# EAGLE schematic schematic (EAGLE 6.3)
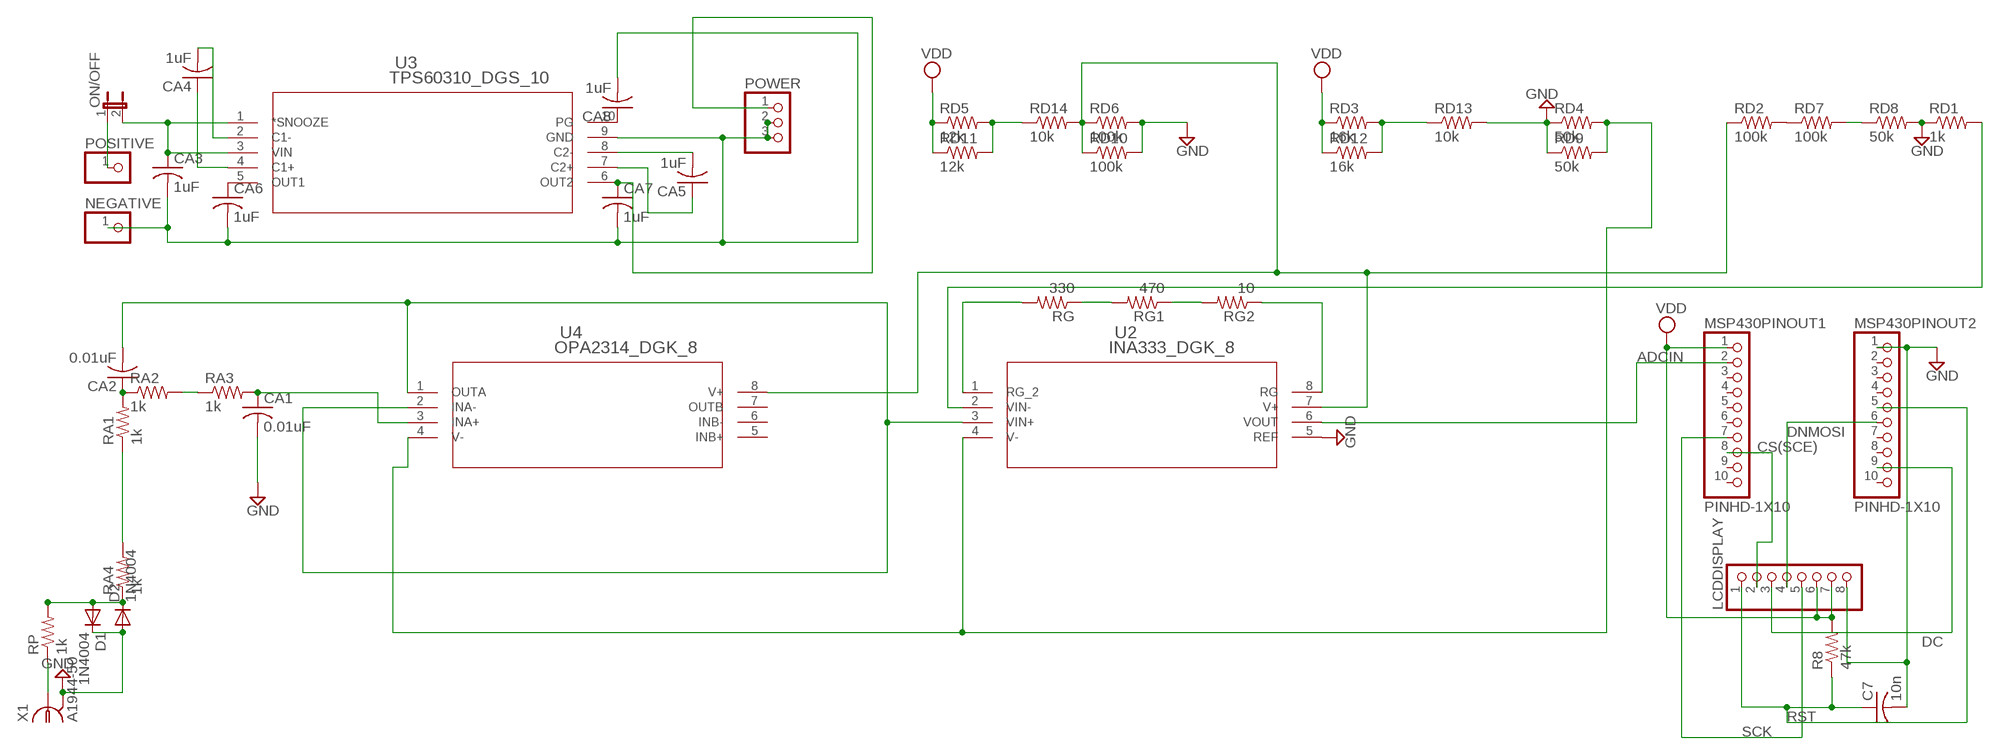
[diagram p0: schematic, sheet 1]

## Parts
C7  10n  C-US025-024X044  [C025-024X044]
CA1  0.01uF  C-US025-024X044  [C025-024X044]
CA2  0.01uF  C-US025-024X044  [C025-024X044]
CA3  1uF  C-US025-024X044  [C025-024X044]
CA4  1uF  C-US025-024X044  [C025-024X044]
CA5  1uF  C-US025-024X044  [C025-024X044]
CA6  1uF  C-US025-024X044  [C025-024X044]
CA7  1uF  C-US025-024X044  [C025-024X044]
CA8  1uF  C-US025-024X044  [C025-024X044]
D1  1N4004  [DO41-10]
D2  1N4004  [DO41-10]
LCDDISPLAY  PINHD-1X8BIG  [1X08-BIG]
MSP430PINOUT1  PINHD-1X10  [1X10-BIG]
MSP430PINOUT2  PINHD-1X10  [1X10-BIG]
NEGATIVE  PINHD-1X1  [1X01]
ON/OFF  JP1E  [JP1]
POSITIVE  PINHD-1X1  [1X01]
POWER  PINHD-1X3  [1X03]
R8  47k  R-US_0204/7  [0204/7]
RA1  1k  R-US_0204/7  [0204/7]
RA2  1k  R-US_0204/7  [0204/7]
RA3  1k  R-US_0204/7  [0204/7]
RA4  1k  R-US_0204/7  [0204/7]
RD1  1k  R-US_0204/7  [0204/7]
RD2  100k  R-US_0204/7  [0204/7]
RD3  16k  R-US_0204/7  [0204/7]
RD4  50k  R-US_0204/7  [0204/7]
RD5  12k  R-US_0204/7  [0204/7]
RD6  100k  R-US_0204/7  [0204/7]
RD7  100k  R-US_0204/7  [0204/7]
RD8  50k  R-US_0204/7  [0204/7]
RD9  50k  R-US_0204/7  [0204/7]
RD10  100k  R-US_0204/7  [0204/7]
RD11  12k  R-US_0204/7  [0204/7]
RD12  16k  R-US_0204/7  [0204/7]
RD13  10k  R-US_0204/7  [0204/7]
RD14  10k  R-US_0204/7  [0204/7]
RG  330  R-US_0204/7  [0204/7]
RG1  470  R-US_0204/7  [0204/7]
RG2  10  R-US_0204/7  [0204/7]
RP  1k  R-US_0204/7  [0204/7]
U2  INA333_DGK_8  [DGK8]
U3  TPS60310_DGS_10  [DGS10]
U4  OPA2314_DGK_8  [DGK8]
X1  A1944-50  [A1944]

## Nets
ADCIN: MSP430PINOUT1.2 U2.6(VOUT)
CS(SCE): LCDDISPLAY.2 MSP430PINOUT1.8
DC: LCDDISPLAY.3 MSP430PINOUT2.9
DNMOSI: LCDDISPLAY.4 MSP430PINOUT2.6
GND: C7.2 CA1.2 D1.C D2.A LCDDISPLAY.8 MSP430PINOUT2.1 RD1.1 RD4.1 RD6.2 RD8.2 RD9.1 RD10.2 RD13.2 U2.5(REF) X1.2(GND)
N$1: CA3.1 ON/OFF.2 U3.1(*SNOOZE) U3.3(VIN)
N$2: RG1.2 RG.1
N$3: RG1.1 RG2.2
N$4: CA2.2 U2.3(VIN+) U4.1(OUTA) U4.2(INA-)
N$5: D1.A D2.C RA4.1 RP.2
N$6: CA6.1 U3.5(OUT1)
N$7: RP.1 X1.1
N$8: CA2.1 RA1.2 RA2.1
N$9: RG2.1 U2.8(RG)
N$10: CA3.2 CA6.2 CA7.2 CA8.2 NEGATIVE.1 POWER.2 POWER.3 U3.9(GND)
N$11: CA4.1 U3.4(C1+)
N$12: CA4.2 U3.2(C1-)
N$13: RA1.1 RA4.2
N$14: CA5.1 U3.7(C2+)
N$15: CA5.2 U3.8(C2-)
N$16: ON/OFF.1 POSITIVE.1
N$17: RA2.2 RA3.1
N$18: CA1.1 RA3.2 U4.3(INA+)
N$19: CA7.1 POWER.1 U3.6(OUT2)
N$20: CA8.1 U3.10(PG)
N$21: RG.2 U2.1(RG_2)
N$22: RD2.2 RD7.1
N$23: RD7.2 RD8.1
N$24: RD5.2 RD11.2 RD14.1
N$25: RD3.2 RD12.2 RD13.1
RST: C7.1 LCDDISPLAY.1 MSP430PINOUT2.5 R8.1
SCK: LCDDISPLAY.5 MSP430PINOUT1.7
VD: RD2.1 RD6.1 RD10.1 RD14.2 U2.7(V+) U4.8(V+)
VDD: LCDDISPLAY.6 LCDDISPLAY.7 MSP430PINOUT1.1 R8.2 RD3.1 RD5.1 RD11.1 RD12.1
VND: RD4.2 RD9.2 U2.4(V-) U4.4(V-)
VZ: RD1.2 U2.2(VIN-)
Unconnected: MSP430PINOUT1.3 MSP430PINOUT1.4 MSP430PINOUT1.5 MSP430PINOUT1.6 MSP430PINOUT1.9 MSP430PINOUT1.10 MSP430PINOUT2.2 MSP430PINOUT2.3 MSP430PINOUT2.4 MSP430PINOUT2.7 MSP430PINOUT2.8 MSP430PINOUT2.10 U4.5(INB+) U4.6(INB-) U4.7(OUTB)

## Power pins joined to a net without a drawn wire
GND: X1.3(GND) X1.4(GND) X1.5(GND)

## Library data of the parts
C7 CA1-CA8 = adafruit:C-US: CAPACITOR, American symbol
D1 D2 = diode:1N4004: DIODE general purpose rectifier, 1 A
LCDDISPLAY = adafruit:PINHD-1X8: PIN HEADER
MSP430PINOUT1 MSP430PINOUT2 = adafruit:PINHD-1X10: Pin header 1x10 0.1" spacing With round pins
NEGATIVE POSITIVE = pinhead:PINHD-1X1: PIN HEADER
ON/OFF = jumper:JP1E: JUMPER
POWER = pinhead:PINHD-1X3: PIN HEADER
R8 RA1-RA4 RD1-RD14 RG RG1 RG2 RP = adafruit:R-US_: RESISTOR, American symbol
U2 = TI-INA333:INA333_DGK_8; DATASHEETURL: http://www.ti.com/lit/gpn/INA333; DESCRIPTION: Low Power, Precision Instrumentation Amplifier; FAMILY_NAME: SINGLE SUPPLY; GENERIC_PART_NUMBER: INA333; INDUSTRY_STD_PKG_TYPE: MSOP; MANUFACTURER: Texas Instruments; MANUFACTURER_PART_NUMBER: ina333_dgk_8; PACKAGE_DESIGNATOR: DGK; PIN_COUNT: 8; VENDOR: Texas Instruments
U3 = TI-TPS60310:TPS60310_DGS_10; DATASHEETURL: http://www.ti.com/lit/gpn/TPS60310; DESCRIPTION: Single-Cell to 3.3-V, 20-mA Ultra-Low Quiescent Current Charge Pump; FAMILY_NAME: STEP-UP CHARGE PUMP REGULATOR; GENERIC_PART_NUMBER: TPS60310; INDUSTRY_STD_PKG_TYPE: MSOP; MANUFACTURER: Texas Instruments; MANUFACTURER_PART_NUMBER: tps60310_dgs_10; PACKAGE_DESIGNATOR: DGS; PIN_COUNT: 10; VENDOR: Texas Instruments
U4 = TI-OPA2314:OPA2314_DGK_8; DATASHEETURL: http://www.ti.com/lit/gpn/OPA2314; DESCRIPTION: Dual, 3MHz, Low-Power, Low-Noise, RRI/O, 1.8V CMOS Operational Amplifier; FAMILY_NAME: LOW NOISE; GENERIC_PART_NUMBER: OPA2314; INDUSTRY_STD_PKG_TYPE: MSOP; MANUFACTURER: Texas Instruments; MANUFACTURER_PART_NUMBER: opa2314_dgk_8; PACKAGE_DESIGNATOR: DGK; PIN_COUNT: 8; VENDOR: Texas Instruments
X1 = con-coax:A1944-50: BNC CONNECTOR 50 Ohm distributor Buerklin 78F2475; OC_FARNELL: unknown; OC_NEWARK: unknown